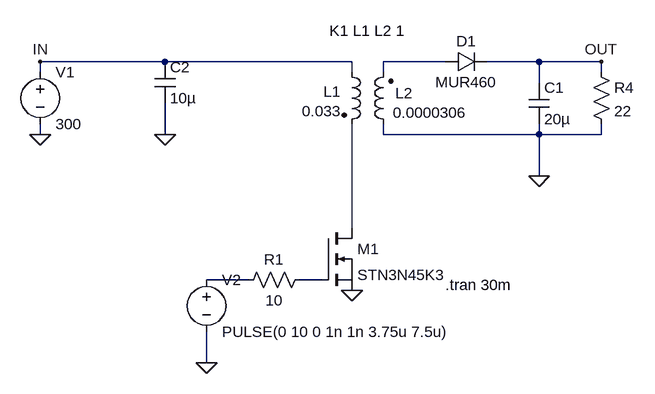
[diagram p0: schematic tp3flyback.asc]
tp3flyback.asc, the LTspice schematic file:
Version 4
SHEET 1 1400 680
WIRE 128 -32 -64 -32
WIRE 416 -32 128 -32
WIRE 560 -32 464 -32
WIRE 704 -32 624 -32
WIRE 800 -32 704 -32
WIRE -64 -16 -64 -32
WIRE 416 -16 416 -32
WIRE 464 -16 464 -32
WIRE 800 -16 800 -32
WIRE 704 0 704 -32
WIRE -64 80 -64 64
WIRE 128 80 128 32
WIRE 464 80 464 64
WIRE 704 80 704 64
WIRE 704 80 464 80
WIRE 800 80 800 64
WIRE 800 80 704 80
WIRE 704 144 704 80
WIRE 416 224 416 64
WIRE 256 304 192 304
WIRE 368 304 336 304
WIRE 192 432 192 384
FLAG -64 80 0
FLAG -64 -32 IN
FLAG 800 -32 OUT
FLAG 192 432 0
FLAG 416 320 0
FLAG 704 144 0
FLAG 128 80 0
SYMBOL voltage -64 -32 R0
WINDOW 123 0 0 Left 2
WINDOW 39 0 0 Left 2
SYMATTR InstName V1
SYMATTR Value 300
SYMBOL ind2 400 -32 R0
WINDOW 0 -1 46 Right 2
WINDOW 3 0 76 Right 2
SYMATTR InstName L1
SYMATTR Value 0.033
SYMATTR Type ind
SYMBOL ind2 480 80 R180
WINDOW 0 -3 64 Right 2
WINDOW 3 1 34 Right 2
SYMATTR InstName L2
SYMATTR Value 0.0000306
SYMATTR Type ind
SYMBOL diode 560 -16 R270
WINDOW 0 32 32 VTop 2
WINDOW 3 0 32 VBottom 2
SYMATTR InstName D1
SYMATTR Value MUR460
SYMBOL cap 688 0 R0
SYMATTR InstName C1
SYMATTR Value 20µ
SYMATTR SpiceLine V=50 Irms=0 Lser=0
SYMBOL res 784 -32 R0
SYMATTR InstName R4
SYMATTR Value 22
SYMBOL nmos 368 224 R0
SYMATTR InstName M1
SYMATTR Value STN3N45K3
SYMBOL voltage 192 288 R0
WINDOW 123 0 0 Left 0
WINDOW 39 0 0 Left 0
SYMATTR InstName V2
SYMATTR Value PULSE(0 10 0 1n 1n 3.75u 7.5u)
SYMBOL cap 112 -32 R0
SYMATTR InstName C2
SYMATTR Value 10µ
SYMBOL res 352 288 R90
WINDOW 0 0 56 VBottom 2
WINDOW 3 32 56 VTop 2
SYMATTR InstName R1
SYMATTR Value 10
TEXT 440 -64 Bottom 2 !K1 L1 L2 1
TEXT 560 312 Left 2 !.tran 30m

The netlist it stands for:
* tp3flyback.asc
V1 IN 0 300
L1 IN N002 0.033
L2 0 N001 0.0000306
D1 N001 OUT MUR460
C1 OUT 0 20µ V=50 Irms=0 Lser=0
R4 OUT 0 22
M1 N002 N004 0 0 STN3N45K3
V2 N003 0 PULSE(0 10 0 1n 1n 3.75u 7.5u)
C2 IN 0 10µ
R1 N004 N003 10
.model D D
.lib standard.dio
.model NMOS NMOS
.model PMOS PMOS
.lib standard.mos
K1 L1 L2 1
.tran 30m
.backanno
.end